# Altium schematic sheet Overview.SchDoc
size A4; SheetNumber: 1; SheetTotal: 5
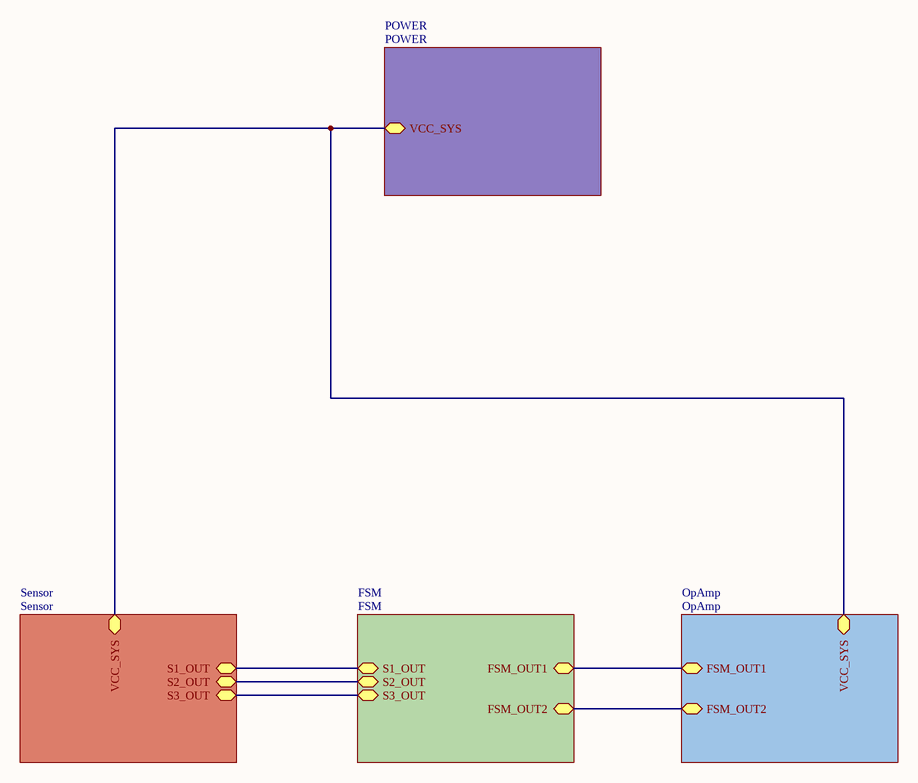
[diagram p0: Overview.SchDoc]

## Sub-sheets
FSM = FSM: S1_OUT (bidir), S2_OUT (bidir), FSM_OUT1 (bidir), FSM_OUT2 (bidir), S3_OUT (bidir)
OpAmp = OpAmp: FSM_OUT1 (bidir), FSM_OUT2 (bidir), VCC_SYS (bidir)
POWER = POWER: VCC_SYS (bidir)
Sensor = Sensor: S2_OUT (bidir), S1_OUT (bidir), VCC_SYS (bidir), S3_OUT (bidir)

## Nets
(unnamed): sheet Sensor/S2_OUT, sheet FSM/S2_OUT
(unnamed): sheet Sensor/S1_OUT, sheet FSM/S1_OUT
(unnamed): sheet Sensor/VCC_SYS, sheet OpAmp/VCC_SYS, sheet POWER/VCC_SYS
(unnamed): sheet Sensor/S3_OUT, sheet FSM/S3_OUT
(unnamed): sheet FSM/FSM_OUT1, sheet OpAmp/FSM_OUT1
(unnamed): sheet FSM/FSM_OUT2, sheet OpAmp/FSM_OUT2